# Altium project 200304 Brake Module R2.PrjPcb
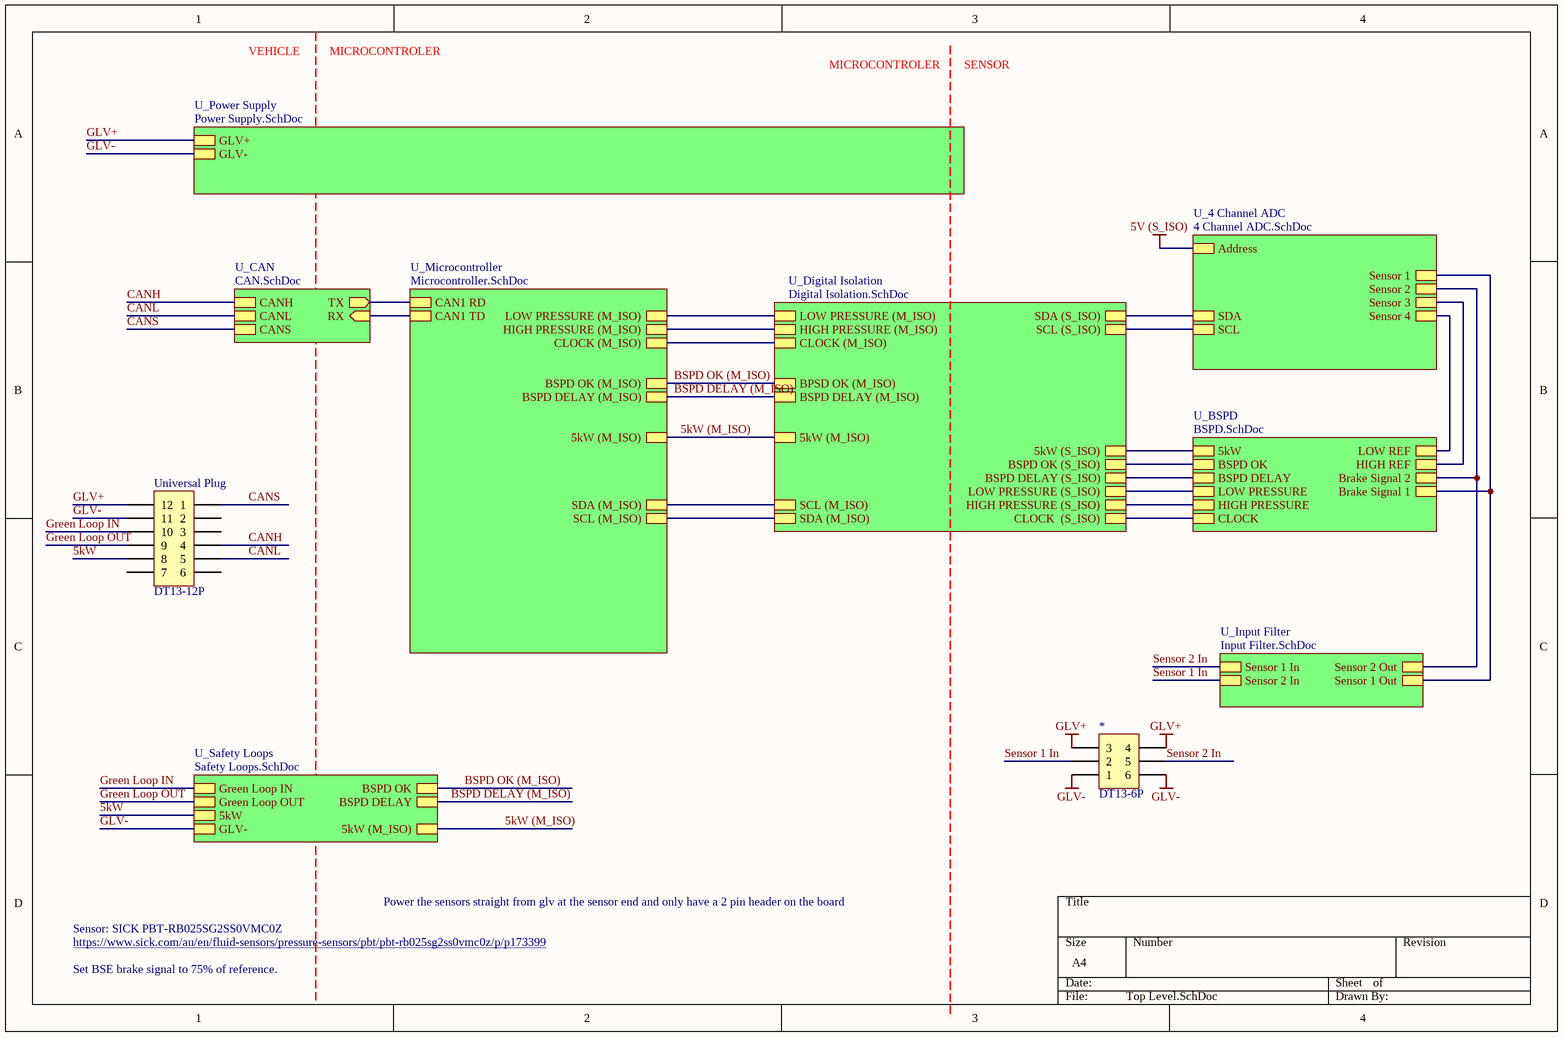
[diagram p0: Top Level.SchDoc]
9 sheets, 166 parts. Net scope: hierarchical (ports join the sheet entries above them; power ports are global).
Board file: Brake Module PCB.PcbDoc
Sheets:
  Top Level.SchDoc
    U_BSPD = BSPD.SchDoc
    U_4 Channel ADC = 4 Channel ADC.SchDoc
    U_Input Filter = Input Filter.SchDoc
    U_Digital Isolation = Digital Isolation.SchDoc
    U_Microcontroller = Microcontroller.SchDoc
    U_Safety Loops = Safety Loops.SchDoc
    U_Power Supply = Power Supply.SchDoc
    U_CAN = CAN.SchDoc

## Sheet Top Level.SchDoc
size A4

### Parts
*  DT13-6P  [DT13-6P]
Universal_Plug  DT13-12P  [DT13-12P]

### Sub-sheets
U_4 Channel ADC = 4 Channel ADC.SchDoc: Address, SCL, SDA, Sensor 1, Sensor 2, Sensor 3, Sensor 4
U_BSPD = BSPD.SchDoc: BSPD OK, HIGH PRESSURE, LOW PRESSURE, CLOCK, HIGH REF, LOW REF, 5kW, Brake Signal 1, Brake Signal 2, BSPD DELAY
U_CAN = CAN.SchDoc: CANS, RX (in), CANL, CANH, TX (out)
U_Digital Isolation = Digital Isolation.SchDoc: SDA (M_ISO), SCL (M_ISO), SDA (S_ISO), SCL (S_ISO), CLOCK (M_ISO), HIGH PRESSURE (M_ISO), LOW PRESSURE (M_ISO), BPSD OK (M_ISO), 5kW (S_ISO), 5kW (M_ISO), BSPD OK (S_ISO), HIGH PRESSURE (S_ISO), LOW PRESSURE (S_ISO), CLOCK  (S_ISO), BSPD DELAY (S_ISO), BSPD DELAY (M_ISO)
U_Input Filter = Input Filter.SchDoc: Sensor 1 In, Sensor 1 Out, Sensor 2 In, Sensor 2 Out
U_Microcontroller = Microcontroller.SchDoc: BSPD OK (M_ISO), 5kW (M_ISO), CLOCK (M_ISO), HIGH PRESSURE (M_ISO), LOW PRESSURE (M_ISO), SDA (M_ISO), SCL (M_ISO), CAN1 RD, CAN1 TD, BSPD DELAY (M_ISO)
U_Power Supply = Power Supply.SchDoc: GLV+, GLV-
U_Safety Loops = Safety Loops.SchDoc: Green Loop OUT, Green Loop IN, BSPD OK, BSPD DELAY, 5kW, 5kW (M_ISO), GLV-

### Nets
GLV+: *.3 *.4 Universal_Plug.12 ; sheet U_Power Supply/GLV+
GLV-: *.1 *.6 Universal_Plug.11 ; sheet U_Safety Loops/GLV-, sheet U_Power Supply/GLV-
5kW: Universal_Plug.8 ; sheet U_Safety Loops/5kW
5kW (M_ISO): sheet U_Digital Isolation/5kW (M_ISO), sheet U_Microcontroller/5kW (M_ISO), sheet U_Safety Loops/5kW (M_ISO)
BSPD DELAY (M_ISO): sheet U_Digital Isolation/BSPD DELAY (M_ISO), sheet U_Microcontroller/BSPD DELAY (M_ISO), sheet U_Safety Loops/BSPD DELAY
BSPD OK: sheet U_BSPD/BSPD OK, sheet U_Digital Isolation/BSPD OK (S_ISO)
BSPD OK (M_ISO): sheet U_Digital Isolation/BPSD OK (M_ISO), sheet U_Microcontroller/BSPD OK (M_ISO), sheet U_Safety Loops/BSPD OK
CANH: Universal_Plug.4 ; sheet U_CAN/CANH
CANL: Universal_Plug.5 ; sheet U_CAN/CANL
CANS: Universal_Plug.1 ; sheet U_CAN/CANS
CLOCK: sheet U_BSPD/CLOCK, sheet U_Digital Isolation/CLOCK  (S_ISO)
Green Loop IN: Universal_Plug.10 ; sheet U_Safety Loops/Green Loop IN
Green Loop OUT: Universal_Plug.9 ; sheet U_Safety Loops/Green Loop OUT
H REF: sheet U_BSPD/HIGH REF, sheet U_4 Channel ADC/Sensor 3
L REF: sheet U_BSPD/LOW REF, sheet U_4 Channel ADC/Sensor 4
Sensor 1 In: *.2 ; sheet U_Input Filter/Sensor 2 In
Sensor 2 In: *.5 ; sheet U_Input Filter/Sensor 1 In
NetC48_2: sheet U_BSPD/Brake Signal 1, sheet U_4 Channel ADC/Sensor 1, sheet U_Input Filter/Sensor 1 Out
NetC49_2: sheet U_BSPD/Brake Signal 2, sheet U_4 Channel ADC/Sensor 2, sheet U_Input Filter/Sensor 2 Out
NetCAN_RX_TP_1: sheet U_Microcontroller/CAN1 TD, sheet U_CAN/RX
NetCAN_TX_TP_1: sheet U_Microcontroller/CAN1 RD, sheet U_CAN/TX
NetP3_1: sheet U_BSPD/5kW, sheet U_Digital Isolation/5kW (S_ISO)
NetP9_1: sheet U_BSPD/HIGH PRESSURE, sheet U_Digital Isolation/HIGH PRESSURE (S_ISO)
NetP11_1: sheet U_BSPD/LOW PRESSURE, sheet U_Digital Isolation/LOW PRESSURE (S_ISO)
NetR6_1: sheet U_BSPD/BSPD DELAY, sheet U_Digital Isolation/BSPD DELAY (S_ISO)
NetR14_1: sheet U_4 Channel ADC/SDA, sheet U_Digital Isolation/SDA (S_ISO)
NetR15_1: sheet U_4 Channel ADC/SCL, sheet U_Digital Isolation/SCL (S_ISO)
NetR16_1: sheet U_Digital Isolation/SDA (M_ISO), sheet U_Microcontroller/SCL (M_ISO)
NetR17_1: sheet U_Digital Isolation/SCL (M_ISO), sheet U_Microcontroller/SDA (M_ISO)
NetU14_10: sheet U_Digital Isolation/LOW PRESSURE (M_ISO), sheet U_Microcontroller/LOW PRESSURE (M_ISO)
NetU14_11: sheet U_Digital Isolation/HIGH PRESSURE (M_ISO), sheet U_Microcontroller/HIGH PRESSURE (M_ISO)
NetU14_12: sheet U_Digital Isolation/CLOCK (M_ISO), sheet U_Microcontroller/CLOCK (M_ISO)

Not connected (* = marked no-connect by the designer): Universal_Plug 2 3 6 7

### Notes on the sheet
- VEHICLE
- MICROCONTROLER
- SENSOR
- Power the sensors straight from glv at the sensor end and only have a 2 pin header on the board
- Sensor: SICK PBT-RB025SG2SS0VMC0Z
- https://www.sick.com/au/en/fluid-sensors/pressure-sensors/pbt/pbt-rb025sg2ss0vmc0z/p/p173399
- Set BSE brake signal to 75% of reference.

### Library data of the parts
* = DT13-6P[[/\]]DT13-6P: Positions: 6; Pitch: 4.44mm; Row Spacing: 6.35mm; Angle: 90; Flange: Yes; Contact: Copper Alloy; Part Number: DT13-6P; Digikey Part Number: 1734-1025-ND; Digikey Link: https://www.digikey.com/product-detail/en/te-connectivity-deutsch-connectors/DT13-6P/1734-1025-ND/6566589
Universal_Plug = DT13-12P[[/\]]DT13-12P: Positions: 12; Pitch: 4.44mm; Row Spacing: 6.35mm; Angle: 90; Flange: Yes; Contact: Nickel; Part Number: DT13-12P; Digikey Part Number: 1734-1451-ND; Digikey Link: https://www.digikey.com.au/product-detail/en/te-connectivity-deutsch-connectors/DT13-12PA/1734-1451-ND/7220123

## Sheet BSPD.SchDoc
size A4
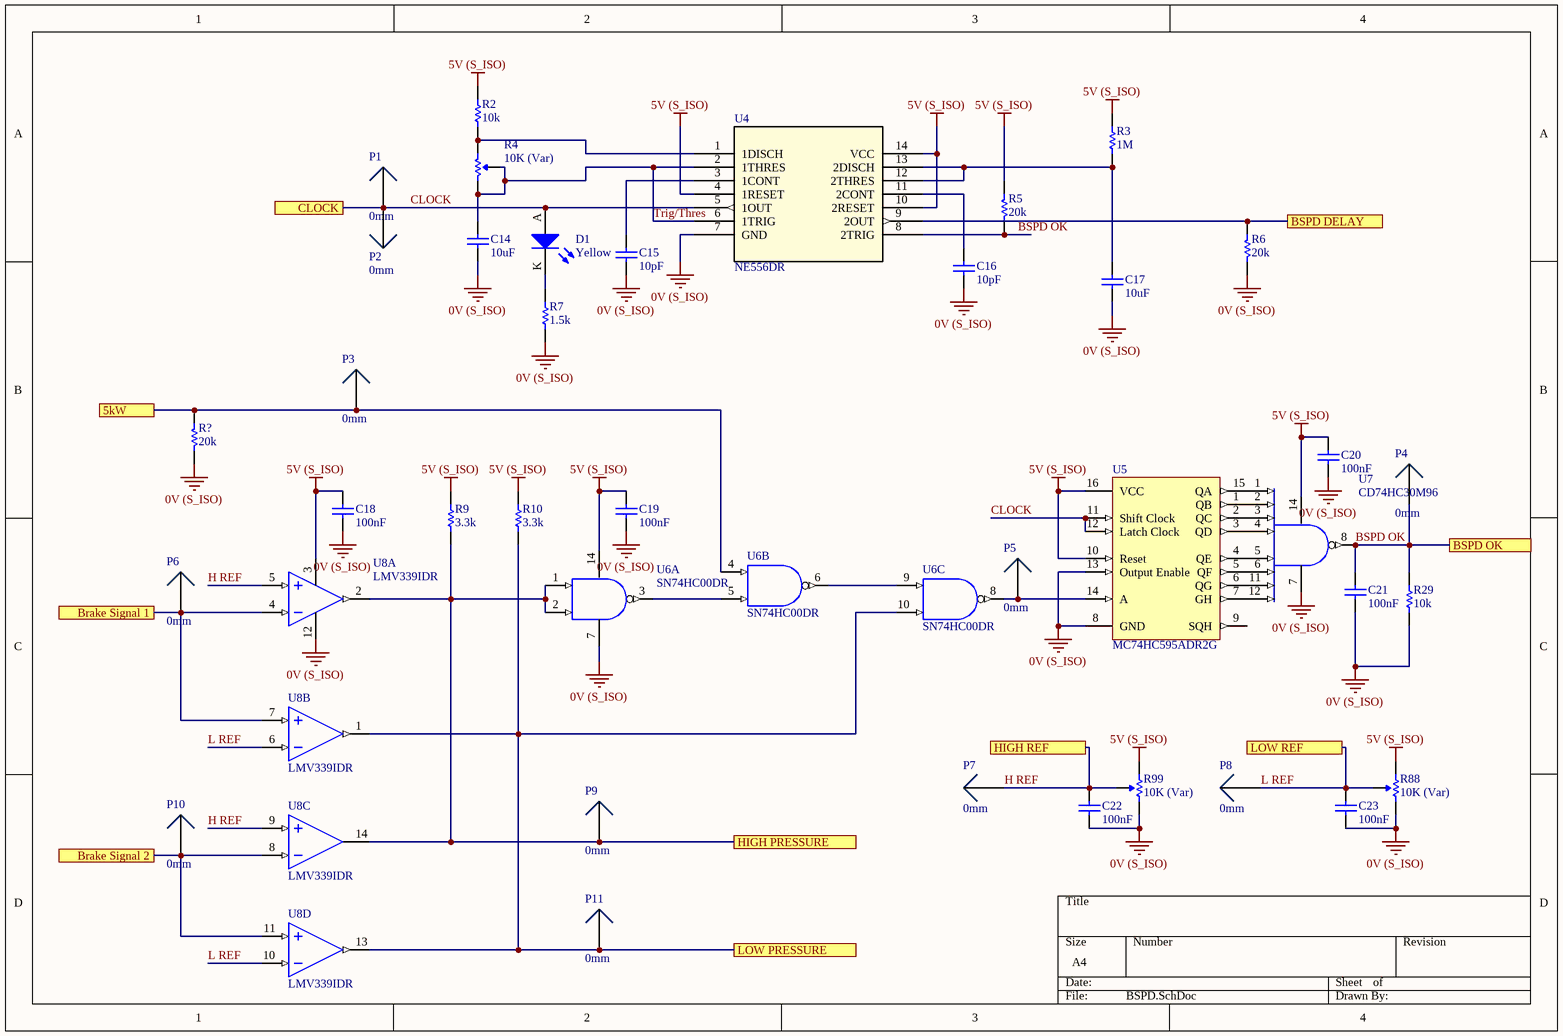
[diagram p1: BSPD.SchDoc]

### Parts
C14  10uF  [0805]
C15  10pF  [0805]
C16  10pF  [0805]
C17  10uF  [0805]
C18  100nF  [0805]
C19  100nF  [0805]
C20  100nF  [0805]
C21  100nF  [0805]
C22  100nF  [0805]
C23  100nF  [0805]
D1  Yellow  [0805 LED]
P1  0mm  [SMD Test Point]
P2  0mm  [TH Test Point]
P3  0mm  [SMD Test Point]
P4  0mm  [SMD Test Point]
P5  0mm  [SMD Test Point]
P6  0mm  [TH Test Point]
P7  0mm  [TH Test Point]
P8  0mm  [TH Test Point]
P9  0mm  [SMD Test Point]
P10  0mm  [TH Test Point]
P11  0mm  [SMD Test Point]
R2  10k  [0805]
R3  1M  [0805]
R4  10K (Var)  [B 3296]
R5  20k  [0805]
R6  20k  [0805]
R7  1.5k  [0805]
R9  3.3k  [0805]
R10  3.3k  [0805]
R29  10k  [0805]
R88  10K (Var)  [B 3296]
R99  10K (Var)  [B 3296]
R?  20k  [0805]
U4  NE556DR  [TI 14-SOIC]
U5  MC74HC595ADR2G  [ON 16-SOIC]
U6  SN74HC00DR  [TI 14-SOIC]  (parts A,B,C of 4)
U7  CD74HC30M96  [TI 14-SOIC]
U8  LMV339IDR  [TI 14-SOIC]  (parts A,B,C,D of 4)

### Ports
5kW, Brake Signal 1, Brake Signal 2, BSPD DELAY, BSPD OK, CLOCK, HIGH PRESSURE, HIGH REF, LOW PRESSURE, LOW REF

### Nets
0V (S_ISO): C14.1 C15.1 C16.1 C17.1 C18.1 C19.1 C20.1 C21.1 C22.1 C23.1 R6.2 R7.1 R29.1 R88.1(CCW) R99.1(CCW) R?.2 U4.7(GND) U5.8(GND) U5.13(Output_Enable) U6.7(GND) U7.7(GND) U8.12(V-)
5V (S_ISO): C18.2 C19.2 C20.2 R2.2 R3.2 R5.1 R9.2 R10.2 R88.3(CW) R99.3(CW) U4.4(1RESET) U4.10(2RESET) U4.14(VCC) U5.10(Reset) U5.16(VCC) U6.14(VCC) U7.14(VCC) U8.3(V+)
BSPD OK: C21.2 P4.1 R5.2 R29.2 U4.8(2TRIG) U7.8(Output) ; port BSPD OK
CLOCK: D1.A P1.1 P2.1 U4.5(1OUT) U5.11(Shift_Clock) U5.12(Latch_Clock) ; port CLOCK
H REF: C22.2 P7.1 R99.2(Wiper) U8.5(IN_A+) U8.9(IN_C+) ; port HIGH REF
L REF: C23.2 P8.1 R88.2(Wiper) U8.6(IN_B-) U8.10(IN_D-) ; port LOW REF
Trig/Thres: C14.2 R4.1(CCW) R4.2(Wiper) U4.2(1THRES) U4.6(1TRIG)
NetC15_2: C15.2 U4.3(1CONT)
NetC16_2: C16.2 U4.11(2CONT)
NetC17_2: C17.2 R3.1 U4.12(2THRES) U4.13(2DISCH)
NetC48_2: P6.1 U8.4(IN_A-) U8.7(IN_B+) ; port Brake Signal 1
NetC49_2: P10.1 U8.8(IN_C-) U8.11(IN_D+) ; port Brake Signal 2
NetD1_K: D1.K R7.2
NetP3_1: P3.1 R?.1 U6.4(2A) ; port 5kW
NetP5_1: P5.1 U5.14(A) U6.8(3Y)
NetP9_1: P9.1 R9.1 U6.1(1A) U6.2(1B) U8.2(OUT_A) U8.14(OUT_C) ; port HIGH PRESSURE
NetP11_1: P11.1 R10.1 U6.10(3B) U8.1(OUT_B) U8.13(OUT_D) ; port LOW PRESSURE
NetR2_1: R2.1 R4.3(CW) U4.1(1DISCH)
NetR6_1: R6.1 U4.9(2OUT) ; port BSPD DELAY
NetU5_1: U5.1(QB) U7.2(Input)
NetU5_2: U5.2(QC) U7.3(Input)
NetU5_3: U5.3(QD) U7.4(Input)
NetU5_4: U5.4(QE) U7.5(Input)
NetU5_5: U5.5(QF) U7.6(Input)
NetU5_6: U5.6(QG) U7.11(Input)
NetU5_7: U5.7(GH) U7.12(Input)
NetU5_15: U5.15(QA) U7.1(Input)
NetU6_3: U6.3(1Y) U6.5(2B)
NetU6_6: U6.6(2Y) U6.9(3A)

Not connected (* = marked no-connect by the designer): U5 9(SQH)

### Library data of the parts
C14 C17 = GRM21BR6YA106KE43L: Manufacturer: muRata; Tolerance: 10%; Material: X5R; Rated Voltage: 50V; Part Number: GRM21BR6YA106KE43L; Value: 10uF; Digikey Part Number: 490-10514-6-ND
C15 C16 = GCM21B5C1H100JA37L: Manufacturer: muRata; Tolerance: 5%; Material: C0G; Rated Voltage: 50V; Part Number: GCM21B5C1H100JA37L; Value: 10pF
C18-C23 = GCM21BR71E104KA37L: Manufacturer: muRata; Tolerance: 10%; Material: X7R; Rated Voltage: 25V; Part Number: GCM21BR71E104KA37L; Value: 100nF
D1 = SML-211YTT86: Yellow LED Indication - Discrete 1.75V 0805 (2012 Metric); Manufacturer: ROHM Semiconductor; Part Number: SML-211YTT86; Colour: Yellow; Digikey Part Number: 511-1293-1-ND; Digikey Link: https://www.digikey.com/product-detail/en/rohm-semiconductor/SML-211YTT86/511-1293-1-ND/637106
P1 P3-P5 P9 P11 = SMD Test Point: Positions: 1; Row Spacing: 0; Flange: No; Contact: NA; Part Number: SMD Test Point; Pitch: 0mm; Angle: 0
P2 P6-P8 P10 = TH Test Point: Positions: 1; Angle: 0; Flange: No; Contact: NA; Part Number: TH Test Point; Pitch: 0mm; Row Spacing: 0mm
R2 R29 = RC0805FR0710KL: Manufacturer: YAGEO; Tolerance: 0.01; Rated Voltage: 0.125W; Part Number: RC0805FR0710KL; Value: 10k; Material: FR-07
R3 = RC0805FR071ML: Manufacturer: YAGEO; Tolerance: 0.01; Rated Voltage: 0.125W; Part Number: RC0805FR071ML; Value: 1M; Material: FR-07
R4 R88 R99 = 3296W-1-103LF: Manufacturer: Bournes Inc; Tolerance: 0.1; Rated Voltage: 0.5W; Part Number: 3296W-1-103LF; Value: 10K (Var); Digikey Part Number: 3296W-103LF-ND
R5 R6 R? = RC0805FR0720KL: Manufacturer: YAGEO; Tolerance: 0.01; Rated Voltage: 0.125W; Part Number: RC0805FR0720KL; Value: 20k; Material: FR-07
R7 = RC0805FR071K5L: Manufacturer: YAGEO; Tolerance: 0.01; Rated Voltage: 0.125W; Part Number: RC0805FR071K5L; Value: 1.5k; Material: FR-07
R9 R10 = RC0805FR073K3L: Manufacturer: YAGEO; Tolerance: 0.01; Rated Voltage: 0.125W; Part Number: RC0805FR073K3L; Value: 3.3k; Material: FR-07
U4 = NE556DR: IC OSC TIMER DUAL 100KHZ 14SOIC; Manufacturer: Texas Instruments; Part Number: NE556DR; Digikey Part Number: 296-26240-1-ND; Digikey Link: https://www.digikey.com/product-detail/en/texas-instruments/NE556DR/296-26240-1-ND/2254905
U5 = MC74HC595ADR2G: IC SHIFT REGISTR 8BIT 3ST 16SOIC; Manufacturer: ON Semiconductor; Part Number: MC74HC595ADR2G; Digikey Part Number: MC74HC595ADR2GOSCT-ND; Digikey Link: https://www.digikey.com/product-detail/en/on-semiconductor/MC74HC595ADR2G/MC74HC595ADR2GOSCT-ND/1139727
U6 = SN74HC00DR: NAND Gate IC 4 Channel 14-SOIC; Manufacturer: Texas Instruments; Part Number: SN74HC00DR; Digikey Part Number: 296-1187-2-ND; Digikey Link: https://www.digikey.com.au/product-detail/en/texas-instruments/SN74HC00DR/296-1187-2-ND/276830
U7 = CD74HC30M96: IC GATE NAND 1CH 8-INP 14SOIC; Manufacturer: Texas Instruments; Part Number: CD74HC30M96; Digikey Part Number: 296-14521-1-ND; Digikey Link: https://www.digikey.com/product-detail/en/texas-instruments/CD74HC30M96/296-14521-1-ND/555580
U8 = LMV339IDR: Comparator General Purpose Open Collector 14-SOIC; Manufacturer: Texas Instruments; Part Number: LMV339IDR; Digikey Part Number: 296-6611-2-ND; Digikey Link: https://www.digikey.com/product-detail/en/texas-instruments/LMV339MTX-NOPB/296-35446-1-ND/3739150

## Sheet 4 Channel ADC.SchDoc
size A4
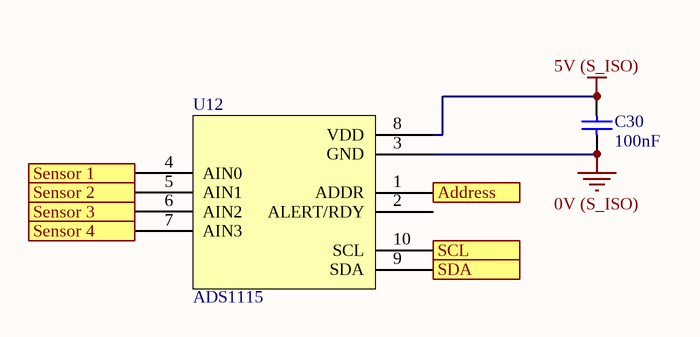
[diagram p2: 4 Channel ADC.SchDoc]

### Parts
C30  100nF  [0805]
U12  ADS1115  [TI 10-VSSOP]

### Ports
Address, SCL, SDA, Sensor 1, Sensor 2, Sensor 3, Sensor 4

### Nets
0V (S_ISO): C30.1 U12.3(GND)
5V (S_ISO): C30.2 U12.1(ADDR) U12.8(VDD) ; port Address
H REF: U12.6(AIN2) ; port Sensor 3
L REF: U12.7(AIN3) ; port Sensor 4
NetC48_2: U12.4(AIN0) ; port Sensor 1
NetC49_2: U12.5(AIN1) ; port Sensor 2
NetR14_1: U12.9(SDA) ; port SDA
NetR15_1: U12.10(SCL) ; port SCL

Not connected (* = marked no-connect by the designer): U12 2(ALERT/RDY)

### Library data of the parts
C30 = GCM21BR71E104KA37L: as C18 on sheet BSPD; Part Number: GCM21BR71E104KA37L; Value: 100nF
U12 = ADS1115: 16 Bit Analog to Digital Converter 2, 4 Input 1 Sigma-Delta 10-VSSOP; Manufacturer: Texas Instruments; Part Number: ADS1115; Digikey Part Number: 296-38849-1-ND; Digikey Link: https://www.digikey.com/product-detail/en/texas-instruments/ADS1115IDGSR/296-38849-1-ND/5142969

## Sheet Input Filter.SchDoc
size A4
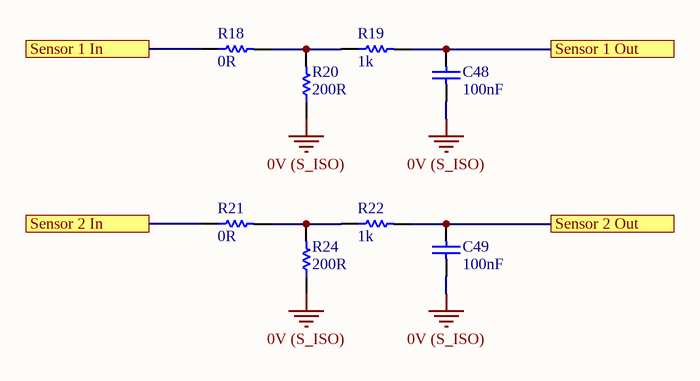
[diagram p3: Input Filter.SchDoc]

### Parts
C48  100nF  [0805]
C49  100nF  [0805]
R18  0R  [0805]
R19  1k  [0805]
R20  200R  [0805]
R21  0R  [0805]
R22  1k  [0805]
R24  200R  [0805]

### Ports
Sensor 1 In, Sensor 1 Out, Sensor 2 In, Sensor 2 Out

### Nets
0V (S_ISO): C48.1 C49.1 R20.1 R24.1
Sensor 1 In: R21.1 ; port Sensor 2 In
Sensor 2 In: R18.1 ; port Sensor 1 In
NetC48_2: C48.2 R19.2 ; port Sensor 1 Out
NetC49_2: C49.2 R22.2 ; port Sensor 2 Out
NetR18_2: R18.2 R19.1 R20.2
NetR21_2: R21.2 R22.1 R24.2

### Library data of the parts
C48 C49 = GCM21BR71E104KA37L: as C18 on sheet BSPD; Part Number: GCM21BR71E104KA37L; Value: 100nF
R18 R21 = RC0805FR070RL: Manufacturer: YAGEO; Tolerance: 0.01; Rated Voltage: 0.125W; Part Number: RC0805FR070RL; Value: 0R; Material: FR-07
R19 R22 = RC0805FR071KL: Manufacturer: YAGEO; Tolerance: 0.01; Rated Voltage: 0.125W; Part Number: RC0805FR071KL; Value: 1k; Material: FR-07
R20 R24 = RC0805FR07200RL: Manufacturer: YAGEO; Tolerance: 0.01; Rated Voltage: 0.125W; Part Number: RC0805FR07200RL; Value: 200R; Material: FR-07

## Sheet Digital Isolation.SchDoc
size A4
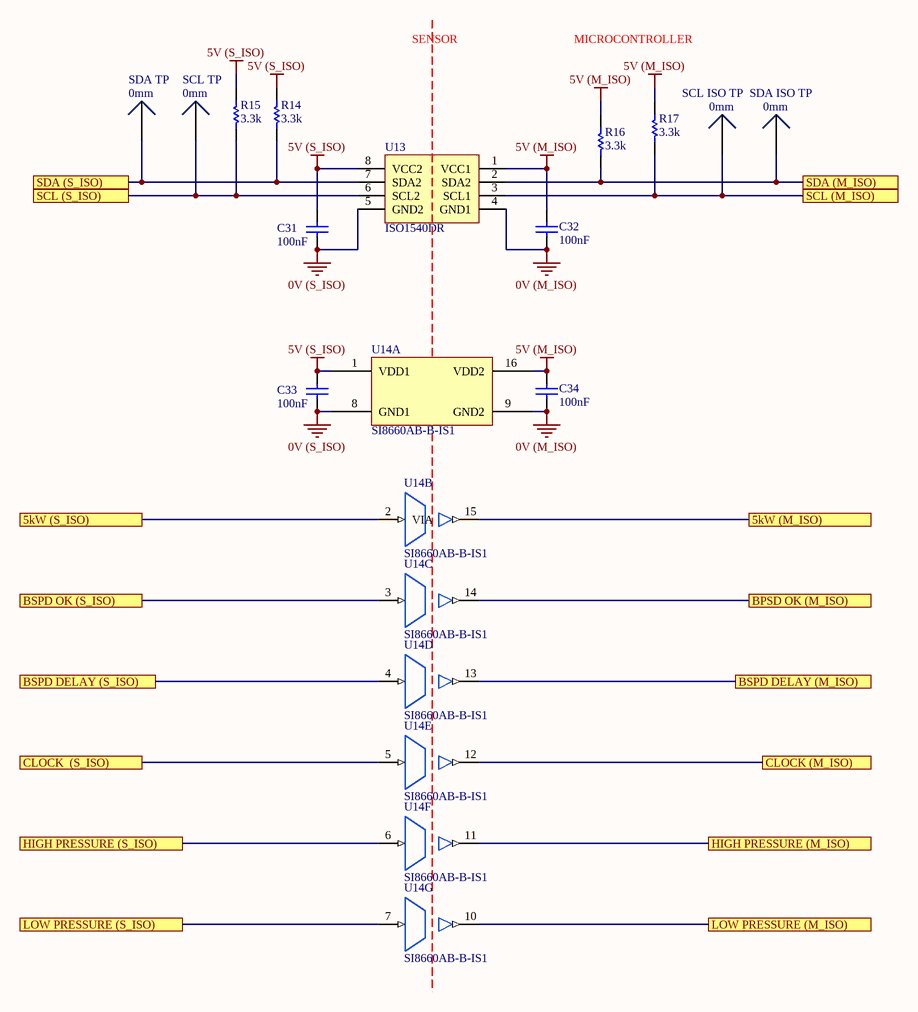
[diagram p4: Digital Isolation.SchDoc]

### Parts
C31  100nF  [0805]
C32  100nF  [0805]
C33  100nF  [0805]
C34  100nF  [0805]
R14  3.3k  [0805]
R15  3.3k  [0805]
R16  3.3k  [0805]
R17  3.3k  [0805]
SCL_ISO_TP  0mm  [SMD Test Point]
SCL_TP  0mm  [SMD Test Point]
SDA_ISO_TP  0mm  [SMD Test Point]
SDA_TP  0mm  [SMD Test Point]
U13  ISO1540DR  [TI 8-SOIC]
U14  SI8660AB-B-IS1  [AD 16-SOIC]  (parts A,B,C,D,E,F,G of 7)

### Ports
5kW (M_ISO), 5kW (S_ISO), BPSD OK (M_ISO), BSPD DELAY (M_ISO), BSPD DELAY (S_ISO), BSPD OK (S_ISO), CLOCK  (S_ISO), CLOCK (M_ISO), HIGH PRESSURE (M_ISO), HIGH PRESSURE (S_ISO), LOW PRESSURE (M_ISO), LOW PRESSURE (S_ISO), SCL (M_ISO), SCL (S_ISO), SDA (M_ISO), SDA (S_ISO)

### Nets
0V (M_ISO): C32.1 C34.1 U13.4(GND1) U14.9(GND2)
0V (S_ISO): C31.1 C33.1 U13.5(GND2) U14.8(GND1)
5V (M_ISO): C32.2 C34.2 R16.2 R17.2 U13.1(VCC1) U14.16(VDD2)
5V (S_ISO): C31.2 C33.2 R14.2 R15.2 U13.8(VCC2) U14.1(VDD1)
5kW (M_ISO): U14.15(VOA) ; port 5kW (M_ISO)
BSPD DELAY (M_ISO): U14.13(VOC) ; port BSPD DELAY (M_ISO)
BSPD OK: U14.3(VIB) ; port BSPD OK (S_ISO)
BSPD OK (M_ISO): U14.14(VOB) ; port BPSD OK (M_ISO)
CLOCK: U14.5(VID) ; port CLOCK  (S_ISO)
NetP3_1: U14.2(VIA) ; port 5kW (S_ISO)
NetP9_1: U14.6(VID) ; port HIGH PRESSURE (S_ISO)
NetP11_1: U14.7(VID) ; port LOW PRESSURE (S_ISO)
NetR6_1: U14.4(VIC) ; port BSPD DELAY (S_ISO)
NetR14_1: R14.1 SDA_TP.1 U13.7(SDA2) ; port SDA (S_ISO)
NetR15_1: R15.1 SCL_TP.1 U13.6(SCL2) ; port SCL (S_ISO)
NetR16_1: R16.1 SDA_ISO_TP.1 U13.2(SDA2) ; port SDA (M_ISO)
NetR17_1: R17.1 SCL_ISO_TP.1 U13.3(SCL1) ; port SCL (M_ISO)
NetU14_10: U14.10(VOD) ; port LOW PRESSURE (M_ISO)
NetU14_11: U14.11(VOD) ; port HIGH PRESSURE (M_ISO)
NetU14_12: U14.12(VOD) ; port CLOCK (M_ISO)

### Notes on the sheet
- SENSOR
- MICROCONTROLLER

### Library data of the parts
C31-C34 = GCM21BR71E104KA37L: as C18 on sheet BSPD; Part Number: GCM21BR71E104KA37L; Value: 100nF
R14-R17 = RC0805FR073K3L: as R9 on sheet BSPD; Part Number: RC0805FR073K3L; Value: 3.3k; Material: FR-07
SCL_ISO_TP SCL_TP SDA_ISO_TP SDA_TP = SMD Test Point: as P1 on sheet BSPD; Part Number: SMD Test Point; Pitch: 0mm; Angle: 0
U13 = ISO1540DR: I2C Digital Isolator (Multichannel); Manufacturer: Texas Instruments; Part Number: ISO1540DR; Digikey Part Number: 296-34871-1-ND; Digikey Link: https://www.digikey.com/product-detail/en/texas-instruments/ISO1540DR/296-34871-1-ND/3587214
U14 = SI8660AB-B-IS1: General Purpose Digital Isolator 2500Vrms 6 Channel 1Mbps 35kV/µs CMTI 16-SOIC (0.154", 3.90mm Width); Manufacturer: Silicon Labs; Part Number: SI8660AB-B-IS1; Digikey Part Number: 336-4410-ND; Digikey Link: https://www.digikey.com/product-detail/en/silicon-labs/SI8660AB-B-IS1/336-4410-ND/4576756

## Sheet Microcontroller.SchDoc
size A3
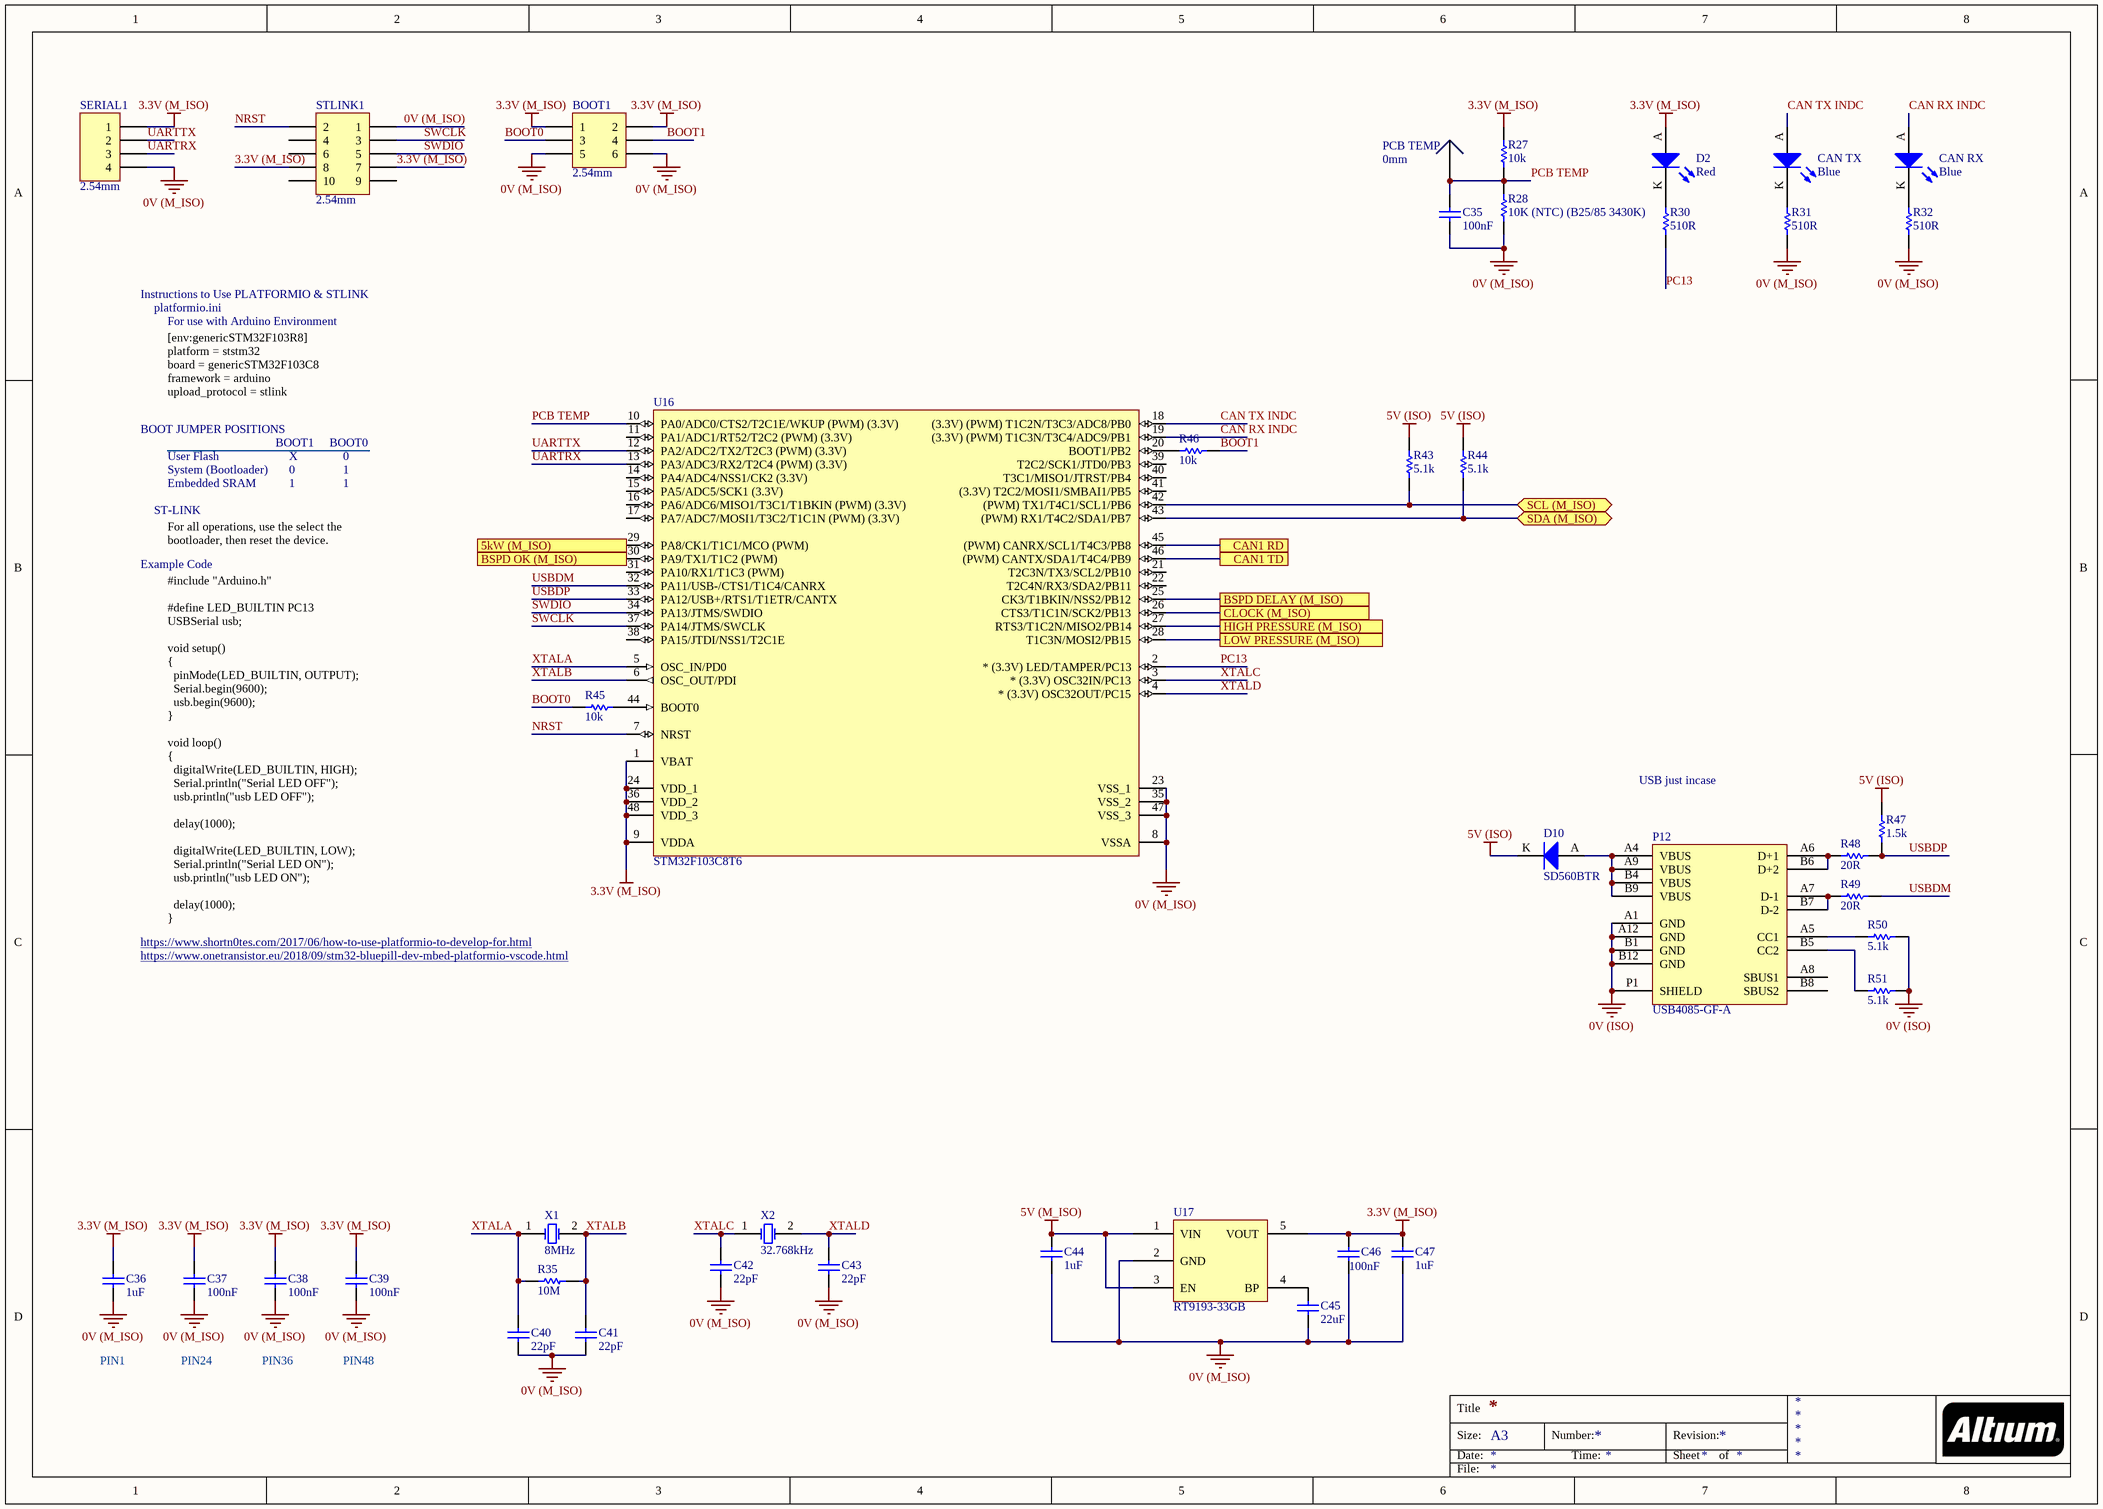
[diagram p5: Microcontroller.SchDoc]

### Parts
BOOT1  2.54mm  [TH 2.54mm Header 2x3]
C35  100nF  [0805]
C36  1uF  [0805]
C37  100nF  [0805]
C38  100nF  [0805]
C39  100nF  [0805]
C40  22pF  [0805]
C41  22pF  [0805]
C42  22pF  [0805]
C43  22pF  [0805]
C44  1uF  [0805]
C45  22uF  [0805]
C46  100nF  [0805]
C47  1uF  [0805]
CAN_RX  Blue  [0805 LED]
CAN_TX  Blue  [0805 LED]
D2  Red  [0805 LED]
D10  SD560BTR  [SMB Diode]
P12  USB4085-GF-A  [USB4085-GF-A]
PCB_TEMP  0mm  [SMD Test Point]
R27  10k  [0805]
R28  10K (NTC) (B25/85 3430K)  [0805]
R30  510R  [0805]
R31  510R  [0805]
R32  510R  [0805]
R35  10M  [0805]
R43  5.1k  [0805]
R44  5.1k  [0805]
R45  10k  [0805]
R46  10k  [0805]
R47  1.5k  [0805]
R48  20R  [0805]
R49  20R  [0805]
R50  5.1k  [0805]
R51  5.1k  [0805]
SERIAL1  2.54mm  [TH 2.54mm Header 1x4]
STLINK1  2.54mm  [TH 2.54mm Header 2x5]
U16  STM32F103C8T6  [STM 48-LQFP]
U17  RT9193-33GB  [RICHTEK SOT-23-5]
X1  8MHz  [Abracon HC-49/US]
X2  32.768kHz  [EPSON 2-SMD]

### Ports
5kW (M_ISO), BSPD DELAY (M_ISO), BSPD OK (M_ISO), CAN1 RD, CAN1 TD, CLOCK (M_ISO), HIGH PRESSURE (M_ISO), LOW PRESSURE (M_ISO), SCL (M_ISO) (bidir), SDA (M_ISO) (bidir)

### Nets
0V (ISO): P12.A1(GND) P12.A12(GND) P12.B1(GND) P12.B12(GND) P12.P1(SHIELD) R50.2 R51.2
0V (M_ISO): BOOT1.5 BOOT1.6 C35.1 C36.1 C37.1 C38.1 C39.1 C40.1 C41.1 C42.1 C43.1 C44.1 C45.1 C46.1 C47.1 R28.1 R31.1 R32.1 SERIAL1.4 STLINK1.1 U16.8(VSSA) U16.23(VSS_1) U16.35(VSS_2) U16.47(VSS_3) U17.2(GND)
3.3V (M_ISO): BOOT1.1 BOOT1.2 C36.2 C37.2 C38.2 C39.2 C46.2 C47.2 D2.A R27.2 SERIAL1.1 STLINK1.7 STLINK1.8 U16.1(VBAT) U16.9(VDDA) U16.24(VDD_1) U16.36(VDD_2) U16.48(VDD_3) U17.5(VOUT)
5V (ISO): D10.K R43.2 R44.2 R47.2
5V (M_ISO): C44.2 U17.1(VIN) U17.3(EN)
5kW (M_ISO): U16.29(PA8/CK1/T1C1/MCO_(PWM)) ; port 5kW (M_ISO)
BOOT0: BOOT1.3 R45.1
BOOT1: BOOT1.4 R46.2
BSPD DELAY (M_ISO): U16.25(CK3/T1BKIN/NSS2/PB12) ; port BSPD DELAY (M_ISO)
BSPD OK (M_ISO): U16.30(PA9/TX1/T1C2_(PWM)) ; port BSPD OK (M_ISO)
CAN RX INDC: CAN_RX.A U16.19((3.3V)_(PWM)_T1C3N/T3C4/ADC9/PB1)
CAN TX INDC: CAN_TX.A U16.18((3.3V)_(PWM)_T1C2N/T3C3/ADC8/PB0)
NRST: STLINK1.2 U16.7(NRST)
PC13: R30.1 U16.2(*_(3.3V)_LED/TAMPER/PC13)
PCB TEMP: C35.2 PCB_TEMP.1 R27.1 R28.2 U16.10(PA0/ADC0/CTS2/T2C1E/WKUP_(PWM)_(3.3V))
SWCLK: STLINK1.3 U16.37(PA14/JTMS/SWCLK)
SWDIO: STLINK1.5 U16.34(PA13/JTMS/SWDIO)
UARTRX: SERIAL1.3 U16.13(PA3/ADC3/RX2/T2C4_(PWM)_(3.3V))
UARTTX: SERIAL1.2 U16.12(PA2/ADC2/TX2/T2C3_(PWM)_(3.3V))
USBDM: R49.2 U16.32(PA11/USB-/CTS1/T1C4/CANRX)
USBDP: R47.1 R48.2 U16.33(PA12/USB+/RTS1/T1ETR/CANTX)
XTALA: C40.2 R35.1 U16.5(OSC_IN/PD0) X1.1(OSC1)
XTALB: C41.2 R35.2 U16.6(OSC_OUT/PDI) X1.2(OSC2)
XTALC: C42.2 U16.3(*_(3.3V)_OSC32IN/PC13) X2.1(OSC1)
XTALD: C43.2 U16.4(*_(3.3V)_OSC32OUT/PC15) X2.2(OSC2)
NetC45_2: C45.2 U17.4(BP)
NetCAN_RX_K: CAN_RX.K R32.2
NetCAN_RX_TP_1: U16.46((PWM)_CANTX/SDA1/T4C4/PB9) ; port CAN1 TD
NetCAN_TX_K: CAN_TX.K R31.2
NetCAN_TX_TP_1: U16.45((PWM)_CANRX/SCL1/T4C3/PB8) ; port CAN1 RD
NetD2_K: D2.K R30.2
NetD10_A: D10.A P12.A4(VBUS) P12.A9(VBUS) P12.B4(VBUS) P12.B9(VBUS)
NetP12_A5: P12.A5(CC1) R50.1
NetP12_A6: P12.A6(D+1) P12.B6(D+2) R48.1
NetP12_A7: P12.A7(D-1) P12.B7(D-2) R49.1
NetP12_B5: P12.B5(CC2) R51.1
NetR16_1: R43.1 U16.42((PWM)_TX1/T4C1/SCL1/PB6) ; port SCL (M_ISO)
NetR17_1: R44.1 U16.43((PWM)_RX1/T4C2/SDA1/PB7) ; port SDA (M_ISO)
NetR45_2: R45.2 U16.44(BOOT0)
NetR46_1: R46.1 U16.20(BOOT1/PB2)
NetU14_10: U16.28(T1C3N/MOSI2/PB15) ; port LOW PRESSURE (M_ISO)
NetU14_11: U16.27(RTS3/T1C2N/MISO2/PB14) ; port HIGH PRESSURE (M_ISO)
NetU14_12: U16.26(CTS3/T1C1N/SCK2/PB13) ; port CLOCK (M_ISO)

Not connected (* = marked no-connect by the designer): P12 A8(SBUS1) B8(SBUS2); STLINK1 4 6 9 10; U16 11(PA1/ADC1/RT52/T2C2_(PWM)_(3.3V)) 14(PA4/ADC4/NSS1/CK2_(3.3V)) 15(PA5/ADC5/SCK1_(3.3V)) 16(PA6/ADC6/MISO1/T3C1/T1BKIN_(PWM)_(3.3V)) 17(PA7/ADC7/MOSI1/T3C2/T1C1N_(PWM)_(3.3V)) 21(T2C3N/TX3/SCL2/PB10) 22(T2C4N/RX3/SDA2/PB11) 31(PA10/RX1/T1C3_(PWM)) 38(PA15/JTDI/NSS1/T2C1E) 39(T2C2/SCK1/JTD0/PB3) 40(T3C1/MISO1/JTRST/PB4) 41((3.3V)_T2C2/MOSI1/SMBAI1/PB5)

### Notes on the sheet
- Instructions to Use PLATFORMIO & STLINK
- platformio.ini
- For use with Arduino Environment
- BOOT JUMPER POSITIONS
- [env:genericSTM32F103R8]
  platform = ststm32
  board = genericSTM32F103C8
  framework = arduino
  upload_protocol = stlink
- BOOT1
- BOOT0
- ST-LINK
- User Flash
- System (Bootloader)
- Embedded SRAM
- X
- 1
- 0
- Example Code
- For all operations, use the select the bootloader, then reset the device.
- USB just incase
- #include "Arduino.h"
  #define LED_BUILTIN PC13
  USBSerial usb;
  void setup()
  {
  pinMode(LED_BUILTIN, OUTPUT);
  Serial.begin(9600);
  usb.begin(9600);
  }
  void loop()
  {
  digitalWrite(LED_BUILTIN, HIGH);
  Serial.println("Serial LED OFF");
  usb.println("usb LED OFF");
  delay(1000);
  digitalWrite(LED_BUILTIN, LOW);
  Serial.println("Serial LED ON");
  usb.println("usb LED ON");
  delay(1000);
  }
- https://www.shortn0tes.com/2017/06/how-to-use-platformio-to-develop-for.html
- https://www.onetransistor.eu/2018/09/stm32-bluepill-dev-mbed-platformio-vscode.html
- PIN1
- PIN24
- PIN36
- PIN48
- Title
- Size:
- Date:
- A3
- Number:
- Time:
- Revision:
- Sheet
- of
- File:

### Library data of the parts
BOOT1 = TH 2.54mm Header 2x3: Positions: 6; Angle: 0; Flange: No; Contact: NA; Part Number: TH 2.54mm Header 2x3; Pitch: 2.54mm; Row Spacing: 2.54mm
C35 C37-C39 C46 = GCM21BR71E104KA37L: as C18 on sheet BSPD; Part Number: GCM21BR71E104KA37L; Value: 100nF
C36 C44 C47 = AC0805KKX7R8BB105: Manufacturer: YAGEO; Tolerance: 10%; Material: X7R; Rated Voltage: 25V; Part Number: AC0805KKX7R8BB105; Value: 1uF
C40-C43 = GCM21B5C1H220JA37L: Manufacturer: muRata; Tolerance: 5%; Material: C0G; Rated Voltage: 50V; Part Number: GCM21B5C1H220JA37L; Value: 22pF
C45 = GRM21BR61A226ME51L: Manufacturer: muRata; Tolerance: 20%; Material: X5R; Rated Voltage: 10V; Part Number: GRM21BR61A226ME51L; Value: 22uF; Digikey Part Number: 490-10511-1-ND
CAN_RX CAN_TX = SML-MN2BCTT86C: LED BLUE CLEAR 2012 SMD; Manufacturer: ROHM Semiconductor; Part Number: SML-MN2BCTT86C; Colour: Blue; Digikey Part Number: 846-1207-1-ND; Digikey Link: https://www.digikey.com/product-detail/en/rohm-semiconductor/SMLMN2BCTT86C/846-1207-1-ND/6057239
D2 = SML-210LTT86: Red LED Indication - Discrete 1.75V 0805 (2012 Metric); Manufacturer: ROHM Semiconductor; Part Number: SML-210LTT86; Colour: Red; Digikey Part Number: 511-1286-1-ND; Digikey Link: https://www.digikey.com/product-detail/en/rohm-semiconductor/SML-210LTT86/511-1286-1-ND/637099
D10 = SD560BTR: 1.2V_F 600V 5A SMB; Manufacturer: SMC Diode Solutions; Part Number: SD560BTR; Digikey Part Number: 1655-1530-2-ND; Digikey Link: https://www.digikey.com/product-detail/en/smc-diode-solutions/SD560BTR/1655-1530-2-ND/6022620
P12 = USB4085-GF-A: USB - C (Type - C) USB 2.0 Receptacle Connector 16 Position Through Hole, Right Angle; Angle: 90; Part Number: USB4085-GF-A; Digikey Part Number: 2073-USB4085-GF-ACT-ND; Digikey Link: https://www.digikey.ee/product-detail/en/gct/USB4085-GF-A/2073-USB4085-GF-ACT-ND/9859733
PCB_TEMP = SMD Test Point: as P1 on sheet BSPD; Part Number: SMD Test Point; Pitch: 0mm; Angle: 0
R27 R45 R46 = RC0805FR0710KL: as R2 on sheet BSPD; Part Number: RC0805FR0710KL; Value: 10k; Material: FR-07
R28 = NTCS0805E3103FLT: Manufacturer: Vishay Beyschlag; Tolerance: 0.01; Rated Voltage: 210mW; Part Number: NTCS0805E3103FLT; Value: 10K (NTC) (B25/85 3430K); Digikey Part Number: BC2733CT-ND
R30-R32 = RC0805FR07510RL: Manufacturer: YAGEO; Tolerance: 0.01; Rated Voltage: 0.125W; Part Number: RC0805FR07510RL; Value: 510R; Material: FR-07
R35 = RC0805FR0710ML: Manufacturer: YAGEO; Tolerance: 0.01; Rated Voltage: 0.125W; Part Number: RC0805FR0710ML; Value: 10M; Material: FR-07
R43 R44 R50 R51 = RC0805FR075K1L: Manufacturer: YAGEO; Tolerance: 0.01; Rated Voltage: 0.125W; Part Number: RC0805FR075K1L; Value: 5.1k; Material: FR-07
R47 = RC0805FR071K5L: as R7 on sheet BSPD; Part Number: RC0805FR071K5L; Value: 1.5k; Material: FR-07
R48 R49 = RC0805FR0720RL: Manufacturer: YAGEO; Tolerance: 0.01; Rated Voltage: 0.125W; Part Number: RC0805FR0720RL; Value: 20R; Material: FR-07
SERIAL1 = TH 2.54mm Header 1x4: Positions: 4; Angle: 0; Flange: No; Contact: NA; Part Number: TH 2.54mm Header 1x4; Pitch: 2.54mm; Row Spacing: 2.54mm
STLINK1 = TH 2.54mm Header 2x5: Positions: 10; Angle: 0; Flange: No; Contact: NA; Part Number: TH 2.54mm Header 2x5; Pitch: 2.54mm; Row Spacing: 2.54mm
U16 = STM32F103C8T6: ARM® Cortex®-M3 STM32F1 Microcontroller IC 32-Bit 72MHz 64KB (64K x 8) FLASH; Manufacturer: STMicroelectronics; Part Number: STM32F103C8T6; Digikey Part Number: 497-6063-ND; Digikey Link: https://www.digikey.com/product-detail/en/stmicroelectronics/STM32F103C8T6/497-6063-ND/1646338
U17 = RT9193-33GB: IC REG LINEAR 3.3V 300MA SOT23-5; Manufacturer: Richtek; Part Number: RT9193-33GB; Digikey Part Number: 1028-1014-1-ND; Digikey Link: https://www.digikey.com/products/en?keywords=1028-1014-1-ND
X1 = ABLS-8.000MHZ-B4-T: Manufacturer: Abracon LLC; Load Capacitance: 18pF; ESR: 80R; Part Number: ABLS-8.000MHZ-B4-T; Value: 8MHz; Digikey Part Number: 535-10212-2-ND; Digikey Link: https://www.digikey.com/product-detail/en/abracon-llc/ABLS-8.000MHZ-B4-T/535-10212-2-ND/2184155
X2 = FC-135 32.7680KA-A5: Manufacturer: EPSON; Load Capacitance: 12.5pF; ESR: 70k; Part Number: FC-135 32.7680KA-A5; Value: 32.768kHz; Digikey Part Number: SER4103TR-ND; Digikey Link: https://www.digikey.com/product-detail/en/epson/FC-135-32.7680KA-A5/SER4103TR-ND/5259895

## Sheet Safety Loops.SchDoc
size A4
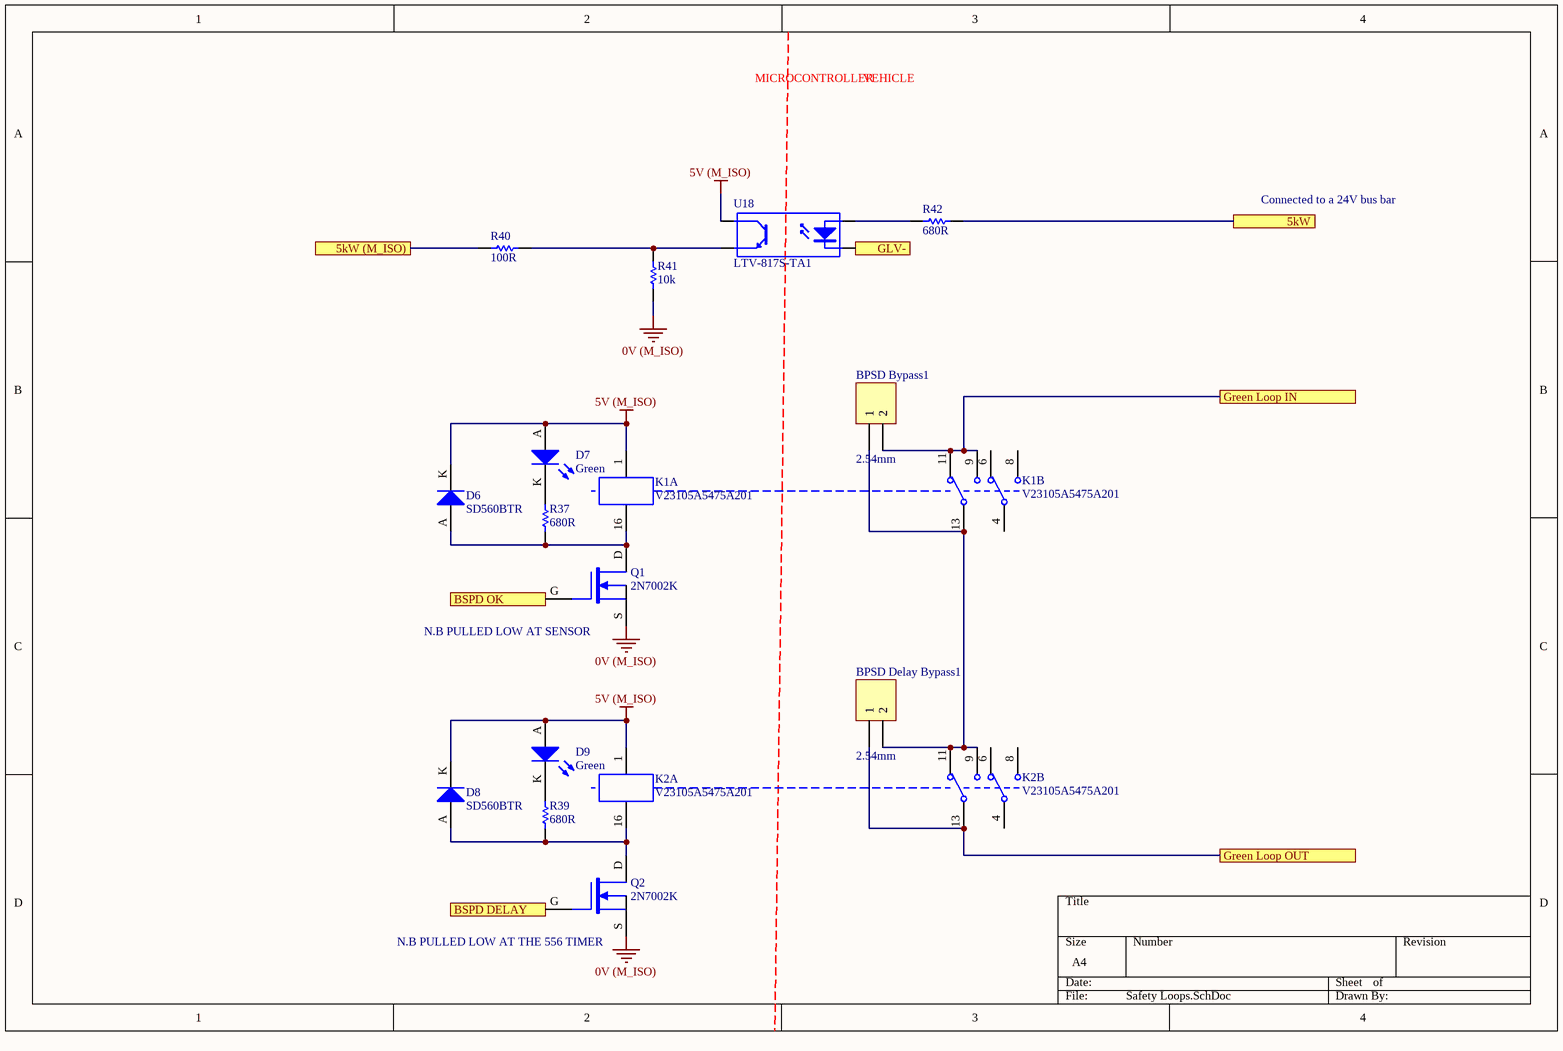
[diagram p6: Safety Loops.SchDoc]

### Parts
BPSD_Bypass1  2.54mm  [TH 2.54mm Header 1x2]
BPSD_Delay_Bypass1  2.54mm  [TH 2.54mm Header 1x2]
D6  SD560BTR  [SMB Diode]
D7  Green  [0805 LED]
D8  SD560BTR  [SMB Diode]
D9  Green  [0805 LED]
K1  V23105A5475A201  [TI 2-DIL]  (parts A,B of 2)
K2  V23105A5475A201  [TI 2-DIL]  (parts A,B of 2)
Q1  2N7002K  [ON SOT-23 MOSFET]
Q2  2N7002K  [ON SOT-23 MOSFET]
R37  680R  [0805]
R39  680R  [0805]
R40  100R  [0805]
R41  10k  [0805]
R42  680R  [0805]
U18  LTV-817S-TA1  [ON 4-SMD]

### Ports
5kW, 5kW (M_ISO), BSPD DELAY, BSPD OK, GLV-, Green Loop IN, Green Loop OUT

### Nets
0V (M_ISO): Q1.S Q2.S R41.1
5V (M_ISO): D6.K D7.A D8.K D9.A K1.1 K2.1 U18.4(C)
GLV-: U18.2(K) ; port GLV-
5kW: R42.2 ; port 5kW
5kW (M_ISO): R40.1 ; port 5kW (M_ISO)
BSPD DELAY (M_ISO): Q2.G ; port BSPD DELAY
BSPD OK (M_ISO): Q1.G ; port BSPD OK
Green Loop IN: BPSD_Bypass1.2 K1.9 K1.11 ; port Green Loop IN
Green Loop OUT: BPSD_Delay_Bypass1.1 K2.13 ; port Green Loop OUT
NetBPSD_Bypass1_1: BPSD_Bypass1.1 BPSD_Delay_Bypass1.2 K1.13 K2.9 K2.11
NetD6_A: D6.A K1.16 Q1.D R37.1
NetD7_K: D7.K R37.2
NetD8_A: D8.A K2.16 Q2.D R39.1
NetD9_K: D9.K R39.2
NetR40_2: R40.2 R41.2 U18.3(E)
NetR42_1: R42.1 U18.1(A)

Not connected (* = marked no-connect by the designer): K1 4 6 8; K2 4 6 8

### Notes on the sheet
- MICROCONTROLLER
- VEHICLE
- Connected to a 24V bus bar
- (near Q1) N.B PULLED LOW AT SENSOR
- (near Q2) N.B PULLED LOW AT THE 556 TIMER

### Library data of the parts
BPSD_Bypass1 BPSD_Delay_Bypass1 = TH 2.54mm Header 1x2: Positions: 2; Angle: 0; Flange: No; Contact: NA; Part Number: TH 2.54mm Header 1x2; Pitch: 2.54mm; Row Spacing: 2.54mm
D6 D8 = SD560BTR: as D10 on sheet Microcontroller; Part Number: SD560BTR; Digikey Part Number: 1655-1530-2-ND; Digikey Link: https://www.digikey.com/product-detail/en/smc-diode-solutions/SD560BTR/1655-1530-2-ND/6022620
D7 D9 = SML-210FTT86: Green LED Indication - Discrete 1.75V 0805 (2012 Metric); Manufacturer: ROHM Semiconductor; Part Number: SML-210FTT86; Colour: Green; Digikey Part Number: 511-1285-1-ND; Digikey Link: https://www.digikey.com/product-detail/en/rohm-semiconductor/SML-210FTT86/511-1285-1-ND/637098
K1 K2 = V23105A5475A201: 5V DPDT Relay 3A 220VDC; Manufacturer: Axicom; Part Number: V23105A5475A201; Digikey Part Number: PB383-ND; Digikey Link: https://www.digikey.com/products/en?mpart=V23105A5001A201&v=41
Q1 Q2 = 2N7002K: 60V 380mA, NFET MOSTFET (Small Signal); Manufacturer: ON Semiconductor; Published: 24-Mar-1999; LatestRevisionDate: 29-May-2009; LatestRevisionNote: IPC-7351 Footprint Added.; PackageVersion: Sep-2000; PackageReference: SOT-343; Publisher: Altium Limited; PackageDescription: 4-Pin SOT-343 Package 1.3 mm Pitch, 2.1 mm Lead Span; Part Number: 2N7002K; Digikey Part Number: 2N7002KCT-ND; Digikey Link: https://www.digikey.com/product-detail/en/on-semiconductor/2N7002K/2N7002KCT-ND/2060375; Qty: 30
R37 R39 R42 = RC0805FR07680RL: Manufacturer: YAGEO; Tolerance: 0.01; Rated Voltage: 0.125W; Part Number: RC0805FR07680RL; Value: 680R; Material: FR-07
R40 = RC0805FR07100RL: Manufacturer: YAGEO; Tolerance: 0.01; Rated Voltage: 0.125W; Part Number: RC0805FR07100RL; Value: 100R; Material: FR-07
R41 = RC0805FR0710KL: as R2 on sheet BSPD; Part Number: RC0805FR0710KL; Value: 10k; Material: FR-07
U18 = LTV-817S-TA1: 35V 50ma Optocoupler (VF=1.2V); Manufacturer: Lite-On Inc; Part Number: LTV-817S-TA1; Digikey Part Number: 160-1893-2-ND; Digikey Link: https://www.digikey.com/product-detail/en/lite-on-inc/LTV-817S-TA1/160-1893-2-ND/388451

## Sheet Power Supply.SchDoc
size A4
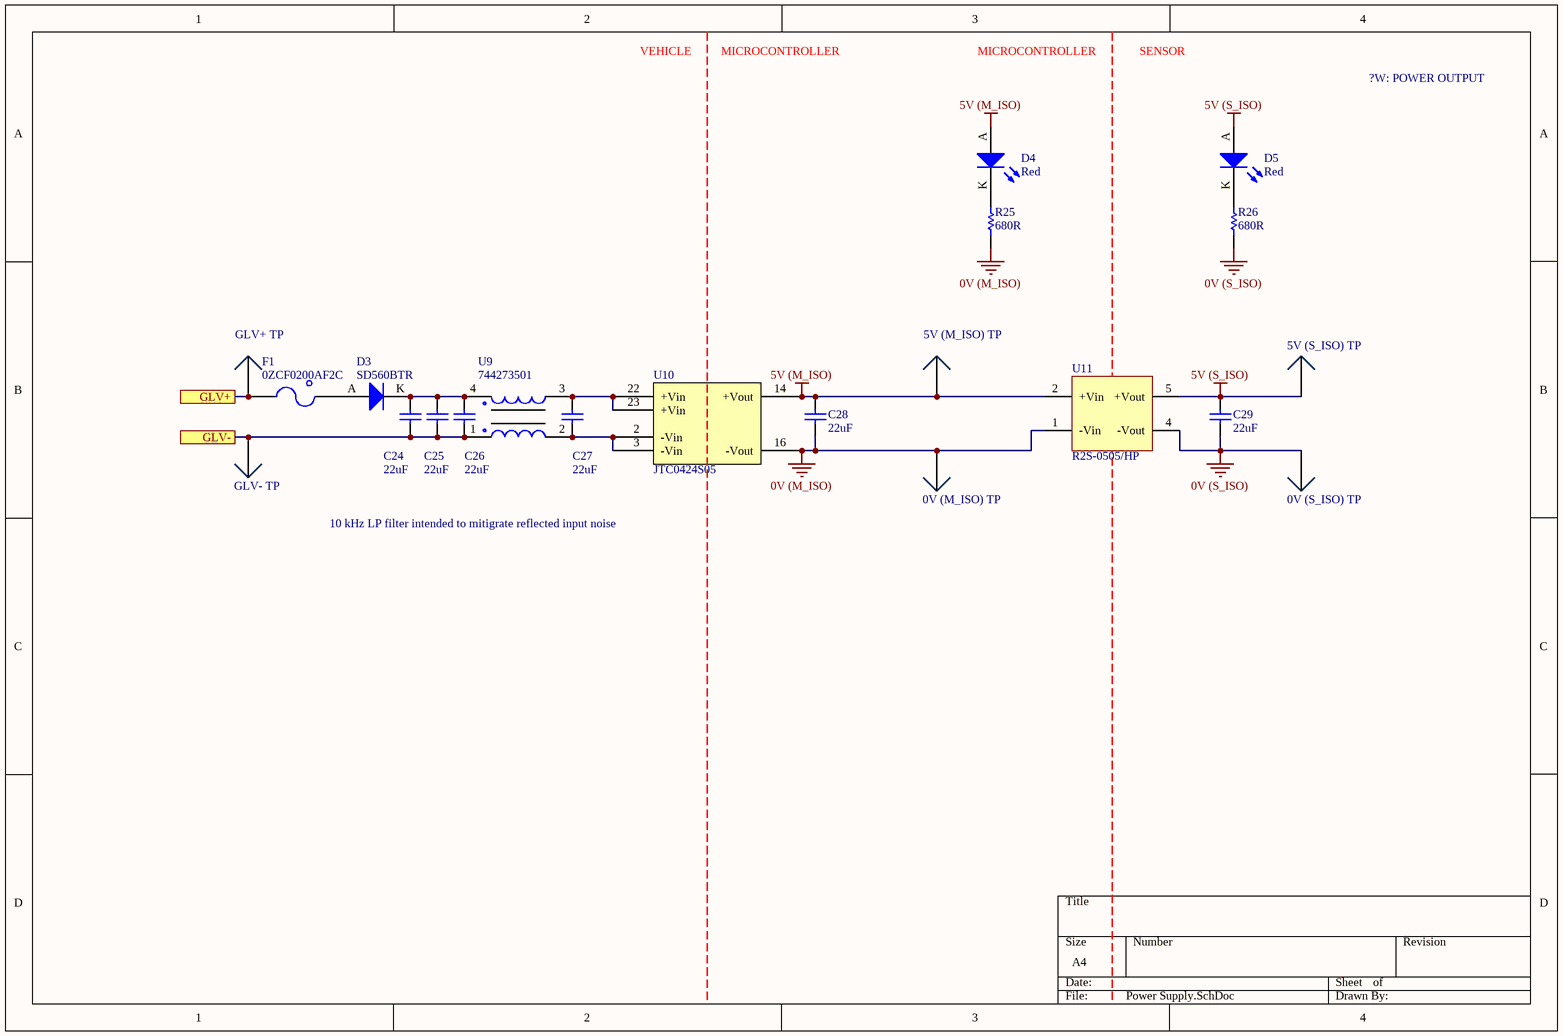
[diagram p7: Power Supply.SchDoc]

### Parts
0V_(M_ISO)_TP  0mm  [SMD Test Point]  (value not drawn)
0V_(S_ISO)_TP  0mm  [SMD Test Point]  (value not drawn)
5V_(M_ISO)_TP  0mm  [SMD Test Point]  (value not drawn)
5V_(S_ISO)_TP  0mm  [SMD Test Point]  (value not drawn)
C24  22uF  [1206]
C25  22uF  [1206]
C26  22uF  [1206]
C27  22uF  [1206]
C28  22uF  [1206]
C29  22uF  [1206]
D3  SD560BTR  [SMB Diode]
D4  Red  [0805 LED]
D5  Red  [0805 LED]
F1  0ZCF0200AF2C  [2920]
GLV+_TP  0mm  [SMD Test Point]  (value not drawn)
GLV-_TP  0mm  [SMD Test Point]  (value not drawn)
R25  680R  [0805]
R26  680R  [0805]
U9  744273501  [Wurth 4-PC Pad]
U10  JTC0424S05  [24-DIP Module, 7 Leads]
U11  R2S-0505/HP  [RECOM 8-SMD (5 Pin)]

### Ports
GLV+, GLV-

### Nets
0V (M_ISO): 0V_(M_ISO)_TP.1 C28.1 R25.1 U10.16(-Vout) U11.1(-Vin)
0V (S_ISO): 0V_(S_ISO)_TP.1 C29.1 R26.1 U11.4(-Vout)
5V (M_ISO): 5V_(M_ISO)_TP.1 C28.2 D4.A U10.14(+Vout) U11.2(+Vin)
5V (S_ISO): 5V_(S_ISO)_TP.1 C29.2 D5.A U11.5(+Vout)
GLV+: F1.1 GLV+_TP.1 ; port GLV+
GLV-: C24.1 C25.1 C26.1 GLV-_TP.1 U9.1 ; port GLV-
NetC24_2: C24.2 C25.2 C26.2 D3.K U9.4
NetC27_1: C27.1 U9.2 U10.2(-Vin) U10.3(-Vin)
NetC27_2: C27.2 U9.3 U10.22(+Vin) U10.23(+Vin)
NetD3_A: D3.A F1.2
NetD4_K: D4.K R25.2
NetD5_K: D5.K R26.2

### Notes on the sheet
- VEHICLE
- MICROCONTROLLER
- SENSOR
- ?W: POWER OUTPUT
- 10 kHz LP filter intended to mitigrate reflected input noise

### Library data of the parts
0V_(M_ISO)_TP 0V_(S_ISO)_TP 5V_(M_ISO)_TP 5V_(S_ISO)_TP GLV+_TP GLV-_TP = SMD Test Point: as P1 on sheet BSPD; Part Number: SMD Test Point; Pitch: 0mm; Angle: 0
C24-C29 = CC1206MKX5R7BB226: Manufacturer: YAGEO; Tolerance: 20%; Material: Ceramic; Rated Voltage: 16V; Part Number: CC1206MKX5R7BB226; Value: 22uF; Digikey Part Number: 311-1997-2-ND
D3 = SD560BTR: as D10 on sheet Microcontroller; Part Number: SD560BTR; Digikey Part Number: 1655-1530-2-ND; Digikey Link: https://www.digikey.com/product-detail/en/smc-diode-solutions/SD560BTR/1655-1530-2-ND/6022620
D4 D5 = SML-210LTT86: as D2 on sheet Microcontroller; Part Number: SML-210LTT86; Colour: Red; Digikey Part Number: 511-1286-1-ND; Digikey Link: https://www.digikey.com/product-detail/en/rohm-semiconductor/SML-210LTT86/511-1286-1-ND/637099
F1 = 0ZCF0200AF2C: SMD 24V 2A Fuse; Manufacturer: Bel Fuse Inc; Part Number: 0ZCF0200AF2C; Digikey Part Number: 507-1749-2-ND; Digikey Link: https://www.digikey.com/product-detail/en/bel-fuse-inc/0ZCF0200AF2C/507-1749-2-ND/4156090
R25 R26 = RC0805FR07680RL: as R37 on sheet Safety Loops; Part Number: RC0805FR07680RL; Value: 680R; Material: FR-07
U9 = 744273501: 5µH @ 100kHz 2 Line Common Mode Choke Surface Mount 500 Ohms @ 130MHz 5A DCR 5.5mOhm; Manufacturer: Wurth Electronics Inc; Part Number: 744273501; Inductance: 5µH @ 100kHz; Impedence: 500 Ohms @ 130MHz; Material: Wirewound; Rated Current: 5A; Digikey Part Number: 732-2214-6-ND; Digikey Link: https://www.digikey.com/product-detail/en/w-rth-elektronik/744273501/732-2214-6-ND/2175826
U10 = JTC0424S05: DC DC CONVERTER 5V 4W; Manufacturer: XP Power; Input Voltage: 9V-36V; Efficiency: 0.79; Isolation: Isolated; Part Number: JTC0424S05; Output Voltage: 5V; Output Power: 4W; Digikey Part Number: JTC0424S05-ND; Digikey Link: https://www.digikey.com/products/en?keywords=%20JTC0424S05
U11 = R2S-0505/HP: Isolated Module DC DC Converter 1 Output 3.3V 606mA 4.5V - 5.5V Input; Manufacturer: Recom; Output Voltage: 5V; Output Power: 2W; Efficiency: 0.85; Part Number: R2S-0505/HP; Input Voltage: 4.5V-5.5V; Isolation: Isolated; Digikey Part Number: 945-1764-5-ND; Digikey Link: https://www.digikey.com/product-detail/en/recom-power/R2S-0505-HP/945-1764-5-ND/2302761

## Sheet CAN.SchDoc
size A4
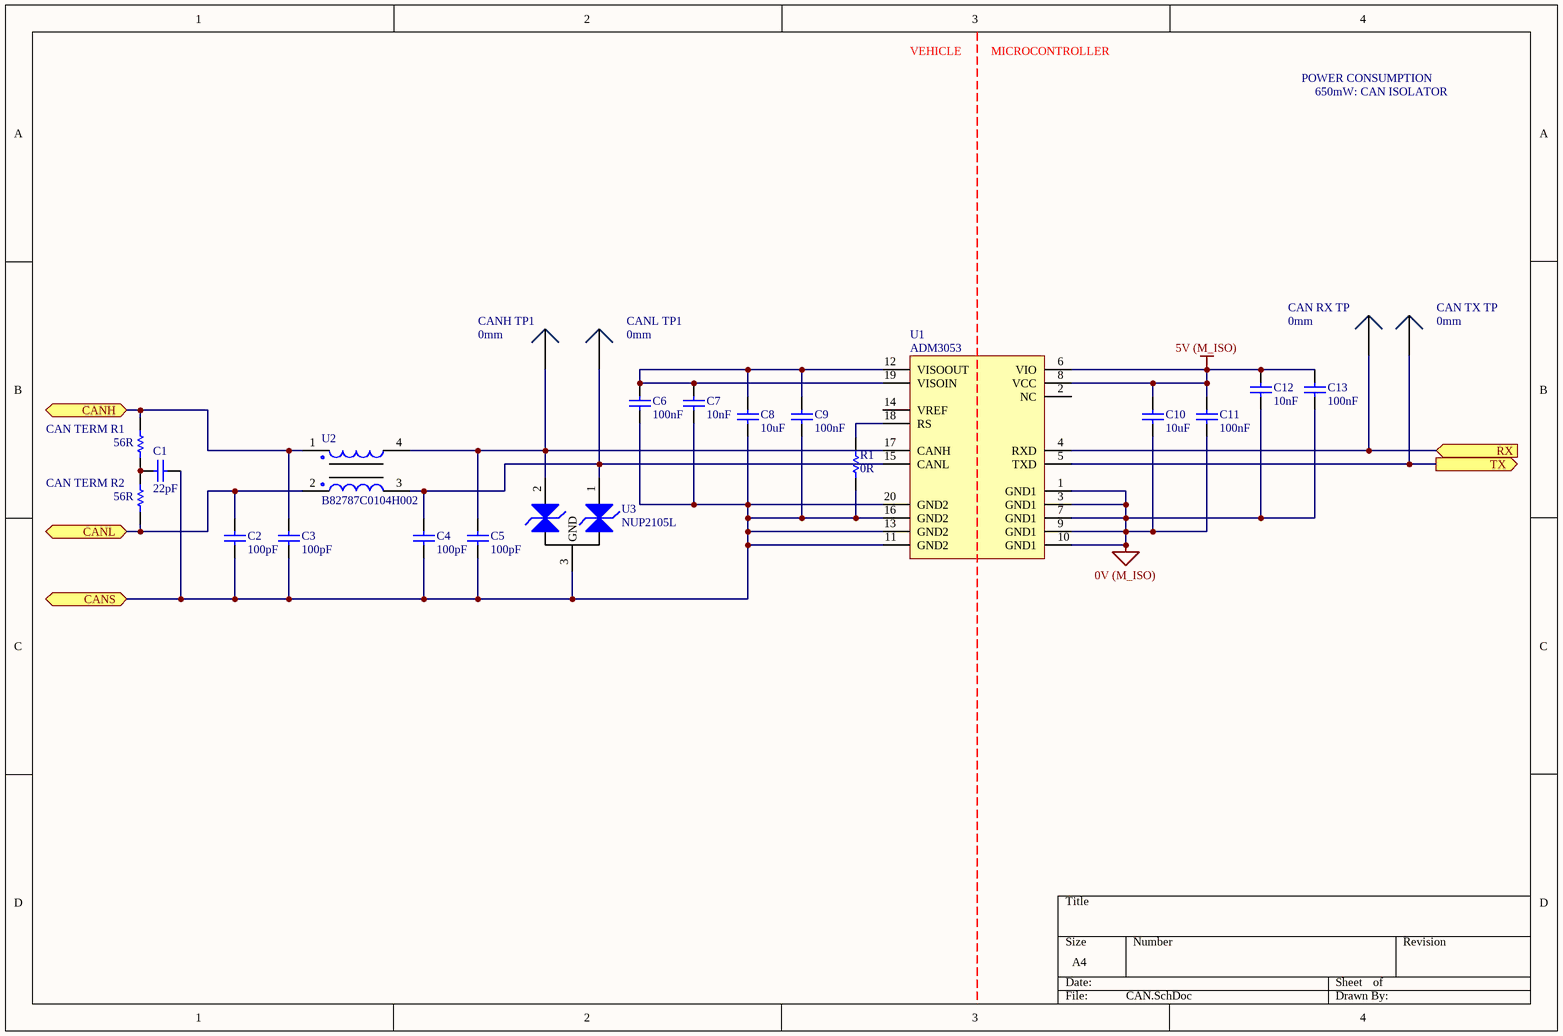
[diagram p8: CAN.SchDoc]

### Parts
C1  22pF  [0805]
C2  100pF  [0805]
C3  100pF  [0805]
C4  100pF  [0805]
C5  100pF  [0805]
C6  100nF  [0805]
C7  10nF  [1206]
C8  10uF  [0805]
C9  100nF  [0805]
C10  10uF  [0805]
C11  100nF  [0805]
C12  10nF  [1206]
C13  100nF  [0805]
CAN_RX_TP  0mm  [SMD Test Point]
CAN_TERM_R1  56R  [0805]
CAN_TERM_R2  56R  [0805]
CAN_TX_TP  0mm  [SMD Test Point]
CANH_TP1  0mm  [SMD Test Point]
CANL_TP1  0mm  [SMD Test Point]
R1  0R  [0805]
U1  ADM3053  [AD SOIC-W 20]
U2  B82787C0104H002  [TDK 4-PC Pad]
U3  NUP2105L  [ON SOT-23]

### Ports
CANH (bidir), CANL (bidir), CANS (bidir), RX (in), TX (out)

### Nets
0V (M_ISO): C10.1 C11.1 C12.1 C13.1 U1.1(GND1) U1.3(GND1) U1.7(GND1) U1.9(GND1) U1.10(GND1)
5V (M_ISO): C10.2 C11.2 C12.2 C13.2 U1.6(VIO) U1.8(VCC)
CANH: C3.2 CAN_TERM_R1.2 U2.1 ; port CANH
CANL: C2.2 CAN_TERM_R2.1 U2.2 ; port CANL
CANS: C1.1 C2.1 C3.1 C4.1 C5.1 C6.1 C7.1 C8.1 C9.1 R1.1 U1.11(GND2) U1.13(GND2) U1.16(GND2) U1.20(GND2) U3.3(GND) ; port CANS
NetC1_2: C1.2 CAN_TERM_R1.1 CAN_TERM_R2.2
NetC4_2: C4.2 CANL_TP1.1 U1.15(CANL) U2.3 U3.1(CAN_H)
NetC5_2: C5.2 CANH_TP1.1 U1.17(CANH) U2.4 U3.2(CAN_L)
NetC6_2: C6.2 C7.2 C8.2 C9.2 U1.12(VISOOUT) U1.19(VISOIN)
NetCAN_RX_TP_1: CAN_RX_TP.1 U1.4(RXD) ; port RX
NetCAN_TX_TP_1: CAN_TX_TP.1 U1.5(TXD) ; port TX
NetR1_2: R1.2 U1.18(RS)

Not connected (* = marked no-connect by the designer): U1 2(NC) 14(VREF)

### Notes on the sheet
- VEHICLE
- MICROCONTROLLER
- POWER CONSUMPTION
- 650mW: CAN ISOLATOR

### Library data of the parts
C1 = GCM21B5C1H220JA37L: as C40 on sheet Microcontroller; Part Number: GCM21B5C1H220JA37L; Value: 22pF
C2-C5 = GCM21B5C1H101JA37L: Manufacturer: muRata; Tolerance: 5%; Material: C0G; Rated Voltage: 50V; Part Number: GCM21B5C1H101JA37L; Value: 100pF
C6 C9 C11 C13 = GCM21BR71E104KA37L: as C18 on sheet BSPD; Part Number: GCM21BR71E104KA37L; Value: 100nF
C7 C12 = GCM3195C2A103JA16D: Manufacturer: muRata; Tolerance: 5%; Material: Ceramic; Rated Voltage: 100V; Part Number: GCM3195C2A103JA16D; Value: 10nF; Digikey Part Number: 490-4978-2-ND
C8 C10 = GRM21BR6YA106KE43L: as C14 on sheet BSPD; Part Number: GRM21BR6YA106KE43L; Value: 10uF; Digikey Part Number: 490-10514-6-ND
CAN_RX_TP CAN_TX_TP CANH_TP1 CANL_TP1 = SMD Test Point: as P1 on sheet BSPD; Part Number: SMD Test Point; Pitch: 0mm; Angle: 0
CAN_TERM_R1 CAN_TERM_R2 = RC0805FR0756RL: Manufacturer: YAGEO; Tolerance: 0.01; Rated Voltage: 0.125W; Part Number: RC0805FR0756RL; Value: 56R; Material: FR-07
R1 = RC0805FR070RL: as R18 on sheet Input Filter; Part Number: RC0805FR070RL; Value: 0R; Material: FR-07
U1 = ADM3053: Isolated CAN Transceiver; Manufacturer: Analogue Devices; Part Number: ADM3053; Digikey Part Number: ADM3053BRWZ-ND; Digikey Link: https://www.digikey.com/product-detail/en/analog-devices-inc/ADM3053BRWZ/ADM3053BRWZ-ND/2709332
U2 = B82787C0104H002: 100µH @ 100kHz 2 Line Common Mode Choke Surface Mount 5.8 kOhms @ 10MHz 150mA DCR 2Ohm; Manufacturer: EPCOS (TDK); Part Number: B82787C0104H002; Inductance: 100µH @ 100kHz; Impedence: 5.8 kOhms @ 10MHz; Material: Wirewound; Rated Current: 150mA; Digikey Part Number: 495-4598-1-ND; Digikey Link: https://www.digikey.com/product-detail/en/epcos-tdk/B82787C0104H002/495-4598-2-ND/3680998
U3 = NUP2105L: Dual Line CAN Bus Protector; Manufacturer: ON Semiconductor; Part Number: NUP2105L; Digikey Part Number: NUP2105LT1GOSCT-ND; Digikey Link: https://www.digikey.com/product-detail/en/on-semiconductor/NUP2105LT1G/NUP2105LT1GOSCT-ND/1485001

## Nets that join several sheets
0V (M_ISO): Digital Isolation (C32.1 C34.1 U13.4 U14.9), Microcontroller (25 pins), Safety Loops (Q1.S Q2.S R41.1), Power Supply (5 pins), CAN (9 pins)
0V (S_ISO): BSPD (22 pins), 4 Channel ADC (C30.1 U12.3), Input Filter (C48.1 C49.1 R20.1 R24.1), Digital Isolation (C31.1 C33.1 U13.5 U14.8), Power Supply (0V_(S_ISO)_TP.1 C29.1 R26.1 U11.4)
5V (M_ISO): Digital Isolation (6 pins), Microcontroller (C44.2 U17.1 U17.3), Safety Loops (7 pins), Power Supply (5 pins), CAN (6 pins)
5V (S_ISO): BSPD (18 pins), 4 Channel ADC (C30.2 U12.1 U12.8), Digital Isolation (6 pins), Power Supply (5V_(S_ISO)_TP.1 C29.2 D5.A U11.5)
GLV+: Top Level (*.3 *.4 Universal_Plug.12), Power Supply (F1.1 GLV+_TP.1)
GLV-: Top Level (*.1 *.6 Universal_Plug.11), Safety Loops (U18.2), Power Supply (5 pins)
5kW: Top Level (Universal_Plug.8), Safety Loops (R42.2)
5kW (M_ISO): Digital Isolation (U14.15), Microcontroller (U16.29), Safety Loops (R40.1)
BSPD DELAY (M_ISO): Digital Isolation (U14.13), Microcontroller (U16.25), Safety Loops (Q2.G)
BSPD OK: BSPD (6 pins), Digital Isolation (U14.3)
BSPD OK (M_ISO): Digital Isolation (U14.14), Microcontroller (U16.30), Safety Loops (Q1.G)
CANH: Top Level (Universal_Plug.4), CAN (C3.2 CAN_TERM_R1.2 U2.1)
CANL: Top Level (Universal_Plug.5), CAN (C2.2 CAN_TERM_R2.1 U2.2)
CANS: Top Level (Universal_Plug.1), CAN (15 pins)
CLOCK: BSPD (6 pins), Digital Isolation (U14.5)
Green Loop IN: Top Level (Universal_Plug.10), Safety Loops (BPSD_Bypass1.2 K1.9 K1.11)
Green Loop OUT: Top Level (Universal_Plug.9), Safety Loops (BPSD_Delay_Bypass1.1 K2.13)
H REF: BSPD (5 pins), 4 Channel ADC (U12.6)
L REF: BSPD (5 pins), 4 Channel ADC (U12.7)
NetC48_2: BSPD (P6.1 U8.4 U8.7), 4 Channel ADC (U12.4), Input Filter (C48.2 R19.2)
NetC49_2: BSPD (P10.1 U8.8 U8.11), 4 Channel ADC (U12.5), Input Filter (C49.2 R22.2)
NetCAN_RX_TP_1: Microcontroller (U16.46), CAN (CAN_RX_TP.1 U1.4)
NetCAN_TX_TP_1: Microcontroller (U16.45), CAN (CAN_TX_TP.1 U1.5)
NetP3_1: BSPD (P3.1 R?.1 U6.4), Digital Isolation (U14.2)
NetP9_1: BSPD (6 pins), Digital Isolation (U14.6)
NetP11_1: BSPD (5 pins), Digital Isolation (U14.7)
NetR6_1: BSPD (R6.1 U4.9), Digital Isolation (U14.4)
NetR14_1: 4 Channel ADC (U12.9), Digital Isolation (R14.1 SDA_TP.1 U13.7)
NetR15_1: 4 Channel ADC (U12.10), Digital Isolation (R15.1 SCL_TP.1 U13.6)
NetR16_1: Digital Isolation (R16.1 SDA_ISO_TP.1 U13.2), Microcontroller (R43.1 U16.42)
NetR17_1: Digital Isolation (R17.1 SCL_ISO_TP.1 U13.3), Microcontroller (R44.1 U16.43)
NetU14_10: Digital Isolation (U14.10), Microcontroller (U16.28)
NetU14_11: Digital Isolation (U14.11), Microcontroller (U16.27)
NetU14_12: Digital Isolation (U14.12), Microcontroller (U16.26)
Sensor 1 In: Top Level (*.2), Input Filter (R21.1)
Sensor 2 In: Top Level (*.5), Input Filter (R18.1)